# Altium schematic sheet InputCircuitsAndSupply.SchDoc
size 420 x 297 mm; Address1: Address1; Address2: Address2; Address3: Address3; Address4: Address4; DocumentNumber: АБВГ.123456.001 Э3; SheetNumber: 1; SheetTotal: 3; Scale: 1:1; DocumentType: Схема электрическая принципиальная; FirstReferrence: АБВГ.123456.001
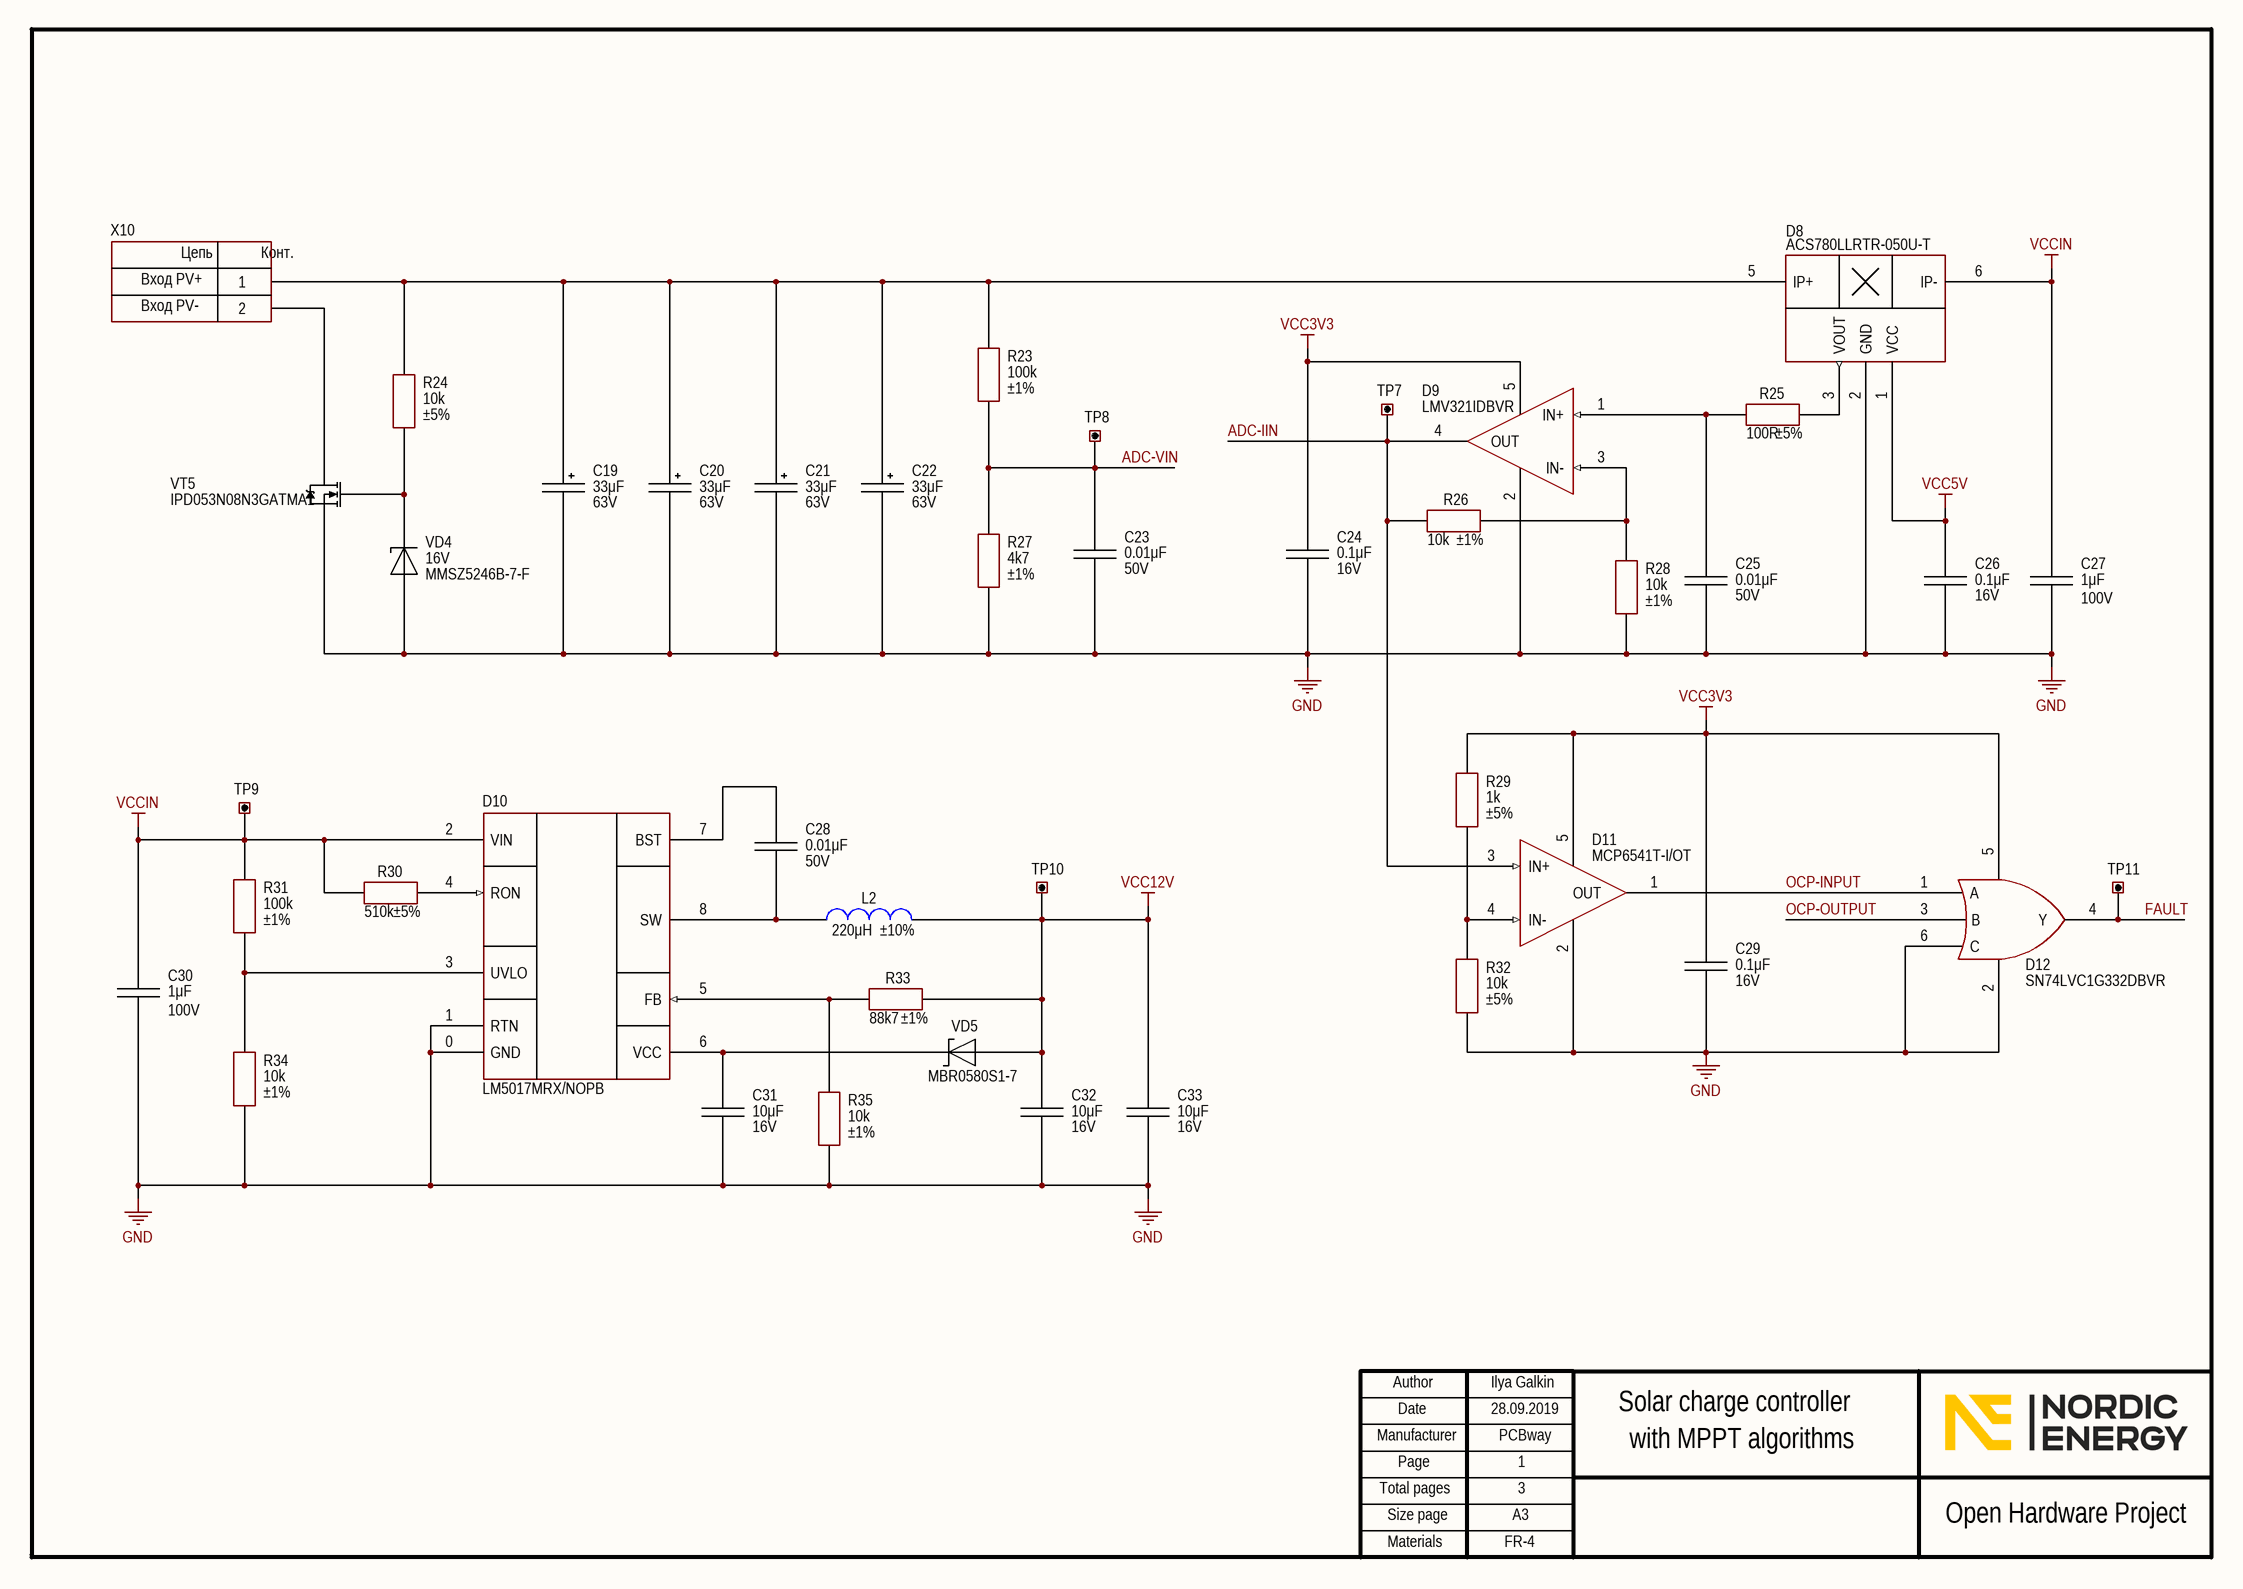
[diagram p0: InputCircuitsAndSupply.SchDoc]

## Parts
C19  value 33μF  Voltage: 63V  [CAP: D8C3.5H12]
C20  value 33μF  Voltage: 63V  [CAP: D8C3.5H12]
C21  value 33μF  Voltage: 63V  [CAP: D8C3.5H12]
C22  value 33μF  Voltage: 63V  [CAP: D8C3.5H12]
C23  value 0.01μF  Voltage: 50V  [CAP: 0805]
C24  value 0.1μF  Voltage: 16V  [CAP: 0805]
C25  value 0.01μF  Voltage: 50V  [CAP: 0805]
C26  value 0.1μF  Voltage: 16V  [CAP: 0805]
C27  value 1μF  Voltage: 100V  [CAP: 1206]
C28  value 0.01μF  Voltage: 50V  [CAP: 0805]
C29  value 0.1μF  Voltage: 16V  [CAP: 0805]
C30  value 1μF  Voltage: 100V  [CAP: 1206]
C31  value 10μF  Voltage: 16V  [CAP: 0805]
C32  value 10μF  Voltage: 16V  [CAP: 0805]
C33  value 10μF  Voltage: 16V  [CAP: 0805]
D8  PartNumber: ACS780LLRTR-050U-T  [SENSOR: ACS781]
D9  (no value)  [SOT23-5]
D10  PartNumber: LM5017MRX/NOPB  [8-SOIC-PAD]
D11  (no value)  [SOT23-5]
D12  (no value)  [SOT23-6]
L2  value 220μH  Tolerance: ±10%  [IND: SDR0805]
R23  value 100k  Tolerance: ±1%  [RES: 0805]
R24  value 10k  Tolerance: ±5%  [RES: 0805]
R25  value 100R  Tolerance: ±5%  [RES: 0805]
R26  value 10k  Tolerance: ±1%  [RES: 0805]
R27  value 4k7  Tolerance: ±1%  [RES: 0805]
R28  value 10k  Tolerance: ±1%  [RES: 0805]
R29  value 1k  Tolerance: ±5%  [RES: 0805]
R30  value 510k  Tolerance: ±5%  [RES: 0805]
R31  value 100k  Tolerance: ±1%  [RES: 0805]
R32  value 10k  Tolerance: ±5%  [RES: 0805]
R33  value 88k7  Tolerance: ±1%  [RES: 0805]
R34  value 10k  Tolerance: ±1%  [RES: 0805]
R35  value 10k  Tolerance: ±1%  [RES: 0805]
TP7  (no value)  [CON: 5004 (Keystone)]
TP8  (no value)  [CON: 5004 (Keystone)]
TP9  (no value)  [CON: 5001 (Keystone)]
TP10  (no value)  [CON: 5001 (Keystone)]
TP11  (no value)  [CON: 5001 (Keystone)]
VD4  Voltage: 16V  PartNumber: MMSZ5246B-7-F  [DIODE: SOD123]
VD5  PartNumber: MBR0580S1-7  [DIODE: SOD123]
VT5  PartNumber: IPD053N08N3GATMA1  [DPAK]
X10  (no value)  [CON: 6PCV-02-006]

## Nets
GND: C19.2 C20.2 C21.2 C22.2 C23.1 C24.1 C25.1 C26.1 C27.1 C29.1 C30.1 C31.1 C32.1 C33.1 D8.2(GND) D9.2(V-) D10.0(GND) D10.1(RTN) D11.2(V-) D12.2 D12.6(C) R27.2 R28.2 R32.2 R34.2 R35.2 VD4.1(A) VT5.2(S)
VCC3V3: C24.2 C29.2 D9.5(V+) D11.5(V+) D12.5 R29.1
VCC5V: C26.2 D8.1(VCC)
VCC12V: C32.2 C33.2 L2.1 R33.2 TP10.1 VD5.1
VCCIN: C27.2 C30.2 D8.6(IP-) D10.2(VIN) R30.1 R31.2 TP9.1
ADC-IIN: D9.4(OUT) D11.3(IN+) R26.1 TP7.1
ADC-VIN: C23.2 R23.2 R27.1 TP8.1
FAULT: D12.4(Y) TP11.1
OCP-INPUT: D11.1(OUT) D12.1(A)
OCP-OUTPUT: D12.3(B)
NetC19_1: C19.1 C20.1 C21.1 C22.1 D8.5(IP+) R23.1 R24.1 X10.1
NetC25_2: C25.2 D9.1(IN+) R25.1
NetC28_1: C28.1 D10.8(SW) L2.2
NetC28_2: C28.2 D10.7(BST)
NetC31_2: C31.2 D10.6(VCC) VD5.2
NetD8_3: D8.3(VOUT) R25.2
NetD9_3: D9.3(IN-) R26.2 R28.1
NetD10_3: D10.3(UVLO) R31.1 R34.1
NetD10_4: D10.4(RON) R30.2
NetD10_5: D10.5(FB) R33.1 R35.1
NetD11_4: D11.4(IN-) R29.2 R32.1
NetR24_2: R24.2 VD4.2(C) VT5.1(G)
NetVT5_3: VT5.3(D) X10.2

## Notes on the sheet
- Вход PV+
- Вход PV-
- Ilya Galkin
- 28.09.2019
- PCBway
- 1
- Solar charge controller
- with MPPT algorithms
- 3
- FR-4
- Author
- Manufacturer
- Date
- Page
- Total pages
- Size page
- A3
- Open Hardware Project
- Materials
- (in symbol Connector_6PCV-02) Цепь; Конт.

## Library data of the parts
C19-C22 = Aluminium: Manufacturer: Panasonic; PartNumber: 63SXE33M; ValueManufacturerPartNumber: Aluminium capacitor, 33μF, 63V, ±20%, 25mOhm, 12x8x3.5 mm, -55...+105°C; TypeCapacitor: Aluminium capacitor; Tolerance: ±20%; Impedance: 25mOhm; Package: 12x8x3.5 mm; HelpURL: https://www.digikey.com/products/en?keywords=%2063SXE33M; Temperature: -55...+105°C
C23 C25 C28 = Ceramic_0805: Manufacturer: Yageo; PartNumber: CC0805KRX7R9BB103; ValueManufacturerPartNumber: Ceramic capacitor, 0.01μF, X7R, ±10%, 50V, 0805, -55...+125°C; TypeCapacitor: Ceramic capacitor; Tolerance: ±10%; TypeDielectric: X7R; Package: 0805; HelpURL: https://www.digikey.com/product-detail/en/yageo/CC0805KRX7R9BB103/311-1136-1-ND/303046; Temperature: -55...+125°C
C24 C26 C29 = Ceramic_0805: Manufacturer: Yageo; PartNumber: CC0805KRX7R7BB104; ValueManufacturerPartNumber: Ceramic capacitor, 0.1μF, X7R, ±10%, 16V, 0805, -55...+125°C; TypeCapacitor: Ceramic capacitor; Tolerance: ±10%; TypeDielectric: X7R; Package: 0805; HelpURL: https://www.digikey.com/product-detail/en/yageo/CC0805KRX7R7BB104/311-1142-1-ND/303052; Temperature: -55...+125°C
C27 C30 = Ceramic_1206: Manufacturer: Samsung; PartNumber: CL31B105KCHNNNE; ValueManufacturerPartNumber: Ceramic capacitor, 1μF, X7R, ±10%, 100V, 1206, -55...+125°C; TypeCapacitor: Ceramic capacitor; Tolerance: ±10%; TypeDielectric: X7R; Package: 1206; HelpURL: https://www.digikey.com/product-detail/en/samsung-electro-mechanics/CL31B105KCHNNNE/1276-1838-1-ND/3889924; Temperature: -55...+125°C
C31-C33 = Ceramic_0805: Manufacturer: Samsung; PartNumber: CL21B106KOQNNNG; ValueManufacturerPartNumber: Ceramic capacitor, 10μF, X7R, ±10%, 16V, 0805, -55...+125°C; TypeCapacitor: Ceramic capacitor; Tolerance: ±10%; TypeDielectric: X7R; Package: 0805; HelpURL: https://www.digikey.com/product-detail/en/samsung-electro-mechanics/CL21B106KOQNNNG/1276-6472-1-ND/5958100; Temperature: -55...+125°C
D8 = ACS780: Current sensors; Manufacturer: Allegro MicroSystems; ValueManufacturerPartNumber: IC current sensors, 50A, ±1.5%, 120 kHz, 60mV/A, -40...+150°C, 7-PSOF; Supply: 4.5...5.5V; Accuracy: ±1.5%; GainBandwidth: 120 kHz; Sensitivity: 60mV/A; Sensing: 50A; HelpURL: https://www.digikey.com/product-detail/en/allegro-microsystems-llc/ACS780LLRTR-050U-T/620-1818-1-ND/6189107; Package: 7-PSOF; ComponentType: IC current sensors; Temperature: -40...+150°C
D9 = LMV321IDBVR: OP amplifier; Manufacturer: Texas Instruments; ValueManufacturerPartNumber: IC op amplifier, Rail-to-Rail, 1 MHz, 2.7...5.5V, -40...+125°C, SOT23-5; Supply: 2.7...5.5V; OutputType: Rail-to-Rail; GainBandwidth: 1 MHz; HelpURL: https://www.digikey.com/product-detail/en/texas-instruments/LMV321IDBVR/296-9567-1-ND/379849; Package: SOT23-5; ComponentType: IC op amplifier; Temperature: -40...+125°C; PartNumber: LMV321IDBVR
D10 = LM5017MRX: Buck converter; Manufacturer: Texas Instruments; ValueManufacturerPartNumber: DC/DC buck converter, input 7.5...100V, 1MHz, output 1.225...90V, 0.6A, -40...+125°C, 8-SOIC; VoltageInput: input 7.5...100V; Frequency: 1MHz; CurrentOutput: 0.6A; VoltageOutput: output 1.225...90V; HelpURL: https://www.digikey.com/product-detail/en/texas-instruments/LM5017SD-NOPB/LM5017SD-NOPBCT-ND/3137455; Package: 8-SOIC; ComponentType: DC/DC buck converter; Temperature: -40...+125°C
D11 = MCP6541T-I/OT: Comparator; Manufacturer: Microchip Technology; ValueManufacturerPartNumber: IC comparator, Rail-to-Rail, 1.6...5.5V, -40...+85°C, SOT23-5; Supply: 1.6...5.5V; OutputType: Rail-to-Rail; HelpURL: https://www.digikey.com/product-detail/en/microchip-technology/MCP6541T-I-OT/MCP6541T-I-OTCT-ND/3622387; Package: SOT23-5; ComponentType: IC comparator; Temperature: -40...+85°C; PartNumber: MCP6541T-I/OT
D12 = SN74LVC1G332DBVR: OR; Manufacturer: Texas Instruments; ValueManufacturerPartNumber: IC logic OR, 1.65...5.5V, -40...+125°C, SOT23-6; Supply: 1.65...5.5V; HelpURL: https://www.digikey.com/product-detail/en/texas-instruments/SN74LVC1G332DBVR/296-18587-1-ND/857355; Package: SOT23-6; ComponentType: IC logic OR; Temperature: -40...+125°C; PartNumber: SN74LVC1G332DBVR
L2 = Inductor_SDR0805: Manufacturer: Bourns; PartNumber: SDR0805-221KL; ValueManufacturerPartNumber: Fixed inductor, 220μH, ±10%, SDR0805, 490mA, -40...+125°C; TypeInductor: Fixed inductor; MaxCurrent: 490mA; Package: SDR0805; HelpURL: https://www.digikey.com/product-detail/en/bourns-inc/SDR0805-221KL/SDR0805-221KLCT-ND/2127164; Temperature: -40...+125°C
R23 R31 = Resistor_0805: Manufacturer: Yageo; PartNumber: RC0805FR-07100KL; ValueManufacturerPartNumber: Resistor film, 100k, ±1%, 0805, 0.125W, -55...+125°C; TypeResistor: Resistor film; Power: 0.125W; Package: 0805; HelpURL: https://www.digikey.com/product-detail/en/yageo/RC0805FR-07100KL/311-100KCRCT-ND/730491; Temperature: -55...+125°C
R24 R32 = Resistor_0805: Manufacturer: Yageo; PartNumber: RC0805JR-0710KL; ValueManufacturerPartNumber: Resistor film, 10k, ±5%, 0805, 0.125W, -55...+125°C; TypeResistor: Resistor film; Power: 0.125W; Package: 0805; HelpURL: https://www.digikey.com/product-detail/en/yageo/RC0805JR-0710KL/311-10KARCT-ND/731188; Temperature: -55...+125°C
R25 = Resistor_0805: Manufacturer: Yageo; PartNumber: RC0805JR-07100RL; ValueManufacturerPartNumber: Resistor film, 100R, ±5%, 0805, 0.125W, -55...+125°C; TypeResistor: Resistor film; Power: 0.125W; Package: 0805; HelpURL: https://www.digikey.com/product-detail/en/yageo/RC0805JR-07100RL/311-100ARCT-ND/731185; Temperature: -55...+125°C
R26 R28 R34 R35 = Resistor_0805: Manufacturer: Yageo; PartNumber: RC0805FR-0710KL; ValueManufacturerPartNumber: Resistor film, 10k, ±1%, 0805, 0.125W, -55...+125°C; TypeResistor: Resistor film; Power: 0.125W; Package: 0805; HelpURL: https://www.digikey.com/product-detail/en/yageo/RC0805FR-0710KL/311-10.0KCRCT-ND/730482; Temperature: -55...+125°C
R27 = Resistor_0805: Manufacturer: Yageo; PartNumber: RC0805FR-074K7L; ValueManufacturerPartNumber: Resistor film, 4k7, ±1%, 0805, 0.125W, -55...+125°C; TypeResistor: Resistor film; Power: 0.125W; Package: 0805; HelpURL: https://www.digikey.com/product-detail/en/yageo/RC0805FR-074K7L/311-4.70KCRCT-ND/730876; Temperature: -55...+125°C
R29 = Resistor_0805: Manufacturer: Yageo; PartNumber: RC0805JR-071KL; ValueManufacturerPartNumber: Resistor film, 1k, ±5%, 0805, 0.125W, -55...+125°C; TypeResistor: Resistor film; Power: 0.125W; Package: 0805; HelpURL: https://www.digikey.com/product-detail/en/yageo/RC0805JR-071KL/311-1.0KARCT-ND/731165; Temperature: -55...+125°C
R30 = Resistor_0805: Manufacturer: Yageo; PartNumber: RC0805JR-07510KL; ValueManufacturerPartNumber: Resistor film, 510k, ±5%, 0805, 0.125W, -55...+125°C; TypeResistor: Resistor film; Power: 0.125W; Package: 0805; HelpURL: https://www.digikey.com/product-detail/en/yageo/RC0805JR-07510KL/311-510KARCT-ND/731291; Temperature: -55...+125°C
R33 = Resistor_0805: Manufacturer: Yageo; PartNumber: RC0805FR-0788K7L; ValueManufacturerPartNumber: Resistor film, 88k7, ±1%, 0805, 0.125W, -55...+125°C; TypeResistor: Resistor film; Power: 0.125W; Package: 0805; HelpURL: https://www.digikey.com/product-detail/en/yageo/RC0805FR-0788K7L/311-88.7KCRCT-ND/731128; Temperature: -55...+125°C
TP7-TP11 = Connector_Test_Point: Manufacturer: Keystone; ValueManufacturerPartNumber: Test point, Keystone, 5001; PartNumber: 5001; TypeConnector: Test point; HelpURL: https://www.digikey.com/product-detail/en/keystone-electronics/5001/36-5001-ND/255327
VD4 = Zener_single: Manufacturer: Diodes Incorporated; ValueManufacturerPartNumber: Zener diode, 16V, 500mW, 0.9V, 17Ohm, SOD-123, -65...+150°C; TypeDiode: Zener diode; Current: 500mW; VoltageDrop: 0.9V; RecoveryTime: 17Ohm; Package: SOD-123; HelpURL: https://www.digikey.com/product-detail/en/diodes-incorporated/MMSZ5246B-7-F/MMSZ5246B-FDICT-ND/717912; Temperature: -65...+150°C
VD5 = Schottky_single: Manufacturer: Diodes Incorporated; ValueManufacturerPartNumber: Schottky diode, 80V, 500mA, 1V, 15pF, SOD-123, -55...+150°C; TypeDiode: Schottky diode; Voltage: 80V; Current: 500mA; VoltageDrop: 1V; RecoveryTime: 15pF; Package: SOD-123; HelpURL: https://www.digikey.com/product-detail/en/diodes-incorporated/MBR0580S1-7/MBR0580S1-7DICT-ND/5080371; Temperature: -55...+150°C
VT5 = MOSFET_N_132: Manufacturer: Infineon Technologies; ValueManufacturerPartNumber: MOSFET N-channel transistor, 80V, 90A, 69nC, 150W, 5.3mOhm, 4750pF, Dpak, -55...+150°C; TypeTransistor: MOSFET N-channel transistor; VoltageDS: 80V; CurrentDS: 90A; RDS: 5.3mOhm; GateCharge: 69nC; InputCapacitor: 4750pF; MaxPower: 150W; Package: Dpak; HelpURL: https://www.digikey.com/product-detail/en/infineon-technologies/IPD053N08N3GATMA1/IPD053N08N3GATMA1CT-ND/5353500; Temperature: -55...+150°C
X10 = Connector_6PCV-02: Manufacturer: TE Connectivity; ValueManufacturerPartNumber: Connector, 2pin, 9.53mm, 300VAC, 25A; PartNumber: 6PCV-02-006; VoltageMax: 300VAC; Pitch: 9.53mm; CurrentMax: 25A; Multichannel: 2pin; CommentText: "Solar panel"; HelpURL: https://www.digikey.com/products/en?keywords=6PCV-02-006; TypeConnector: Connector